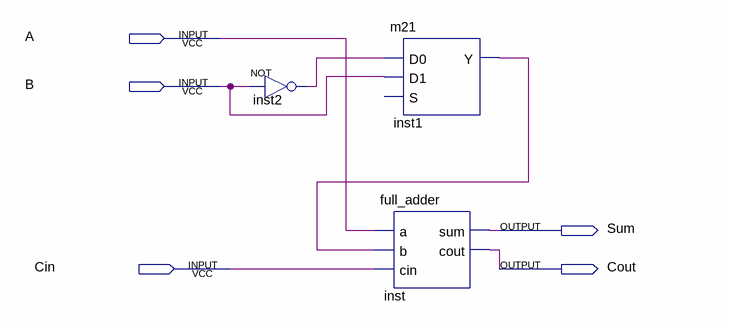
[diagram p0: schematic sheet]
// Quartus schematic 2_1mux.bdf as structural Verilog: 3 symbols, 5 pins
module \2_1mux  (
  input  A,
  input  B,
  input  Cin,
  output Sum,
  output Cout
);

  wire inst1_y, inst2_out;

  not inst2 (inst2_out, B);
  m21 inst1 (.D0(inst2_out), .D1(B), .Y(inst1_y));  // open: S
  full_adder inst (.a(A), .b(inst1_y), .cin(Cin), .sum(Sum), .cout(Cout));
endmodule
